# EAGLE design tv (EAGLE 9.2.2)
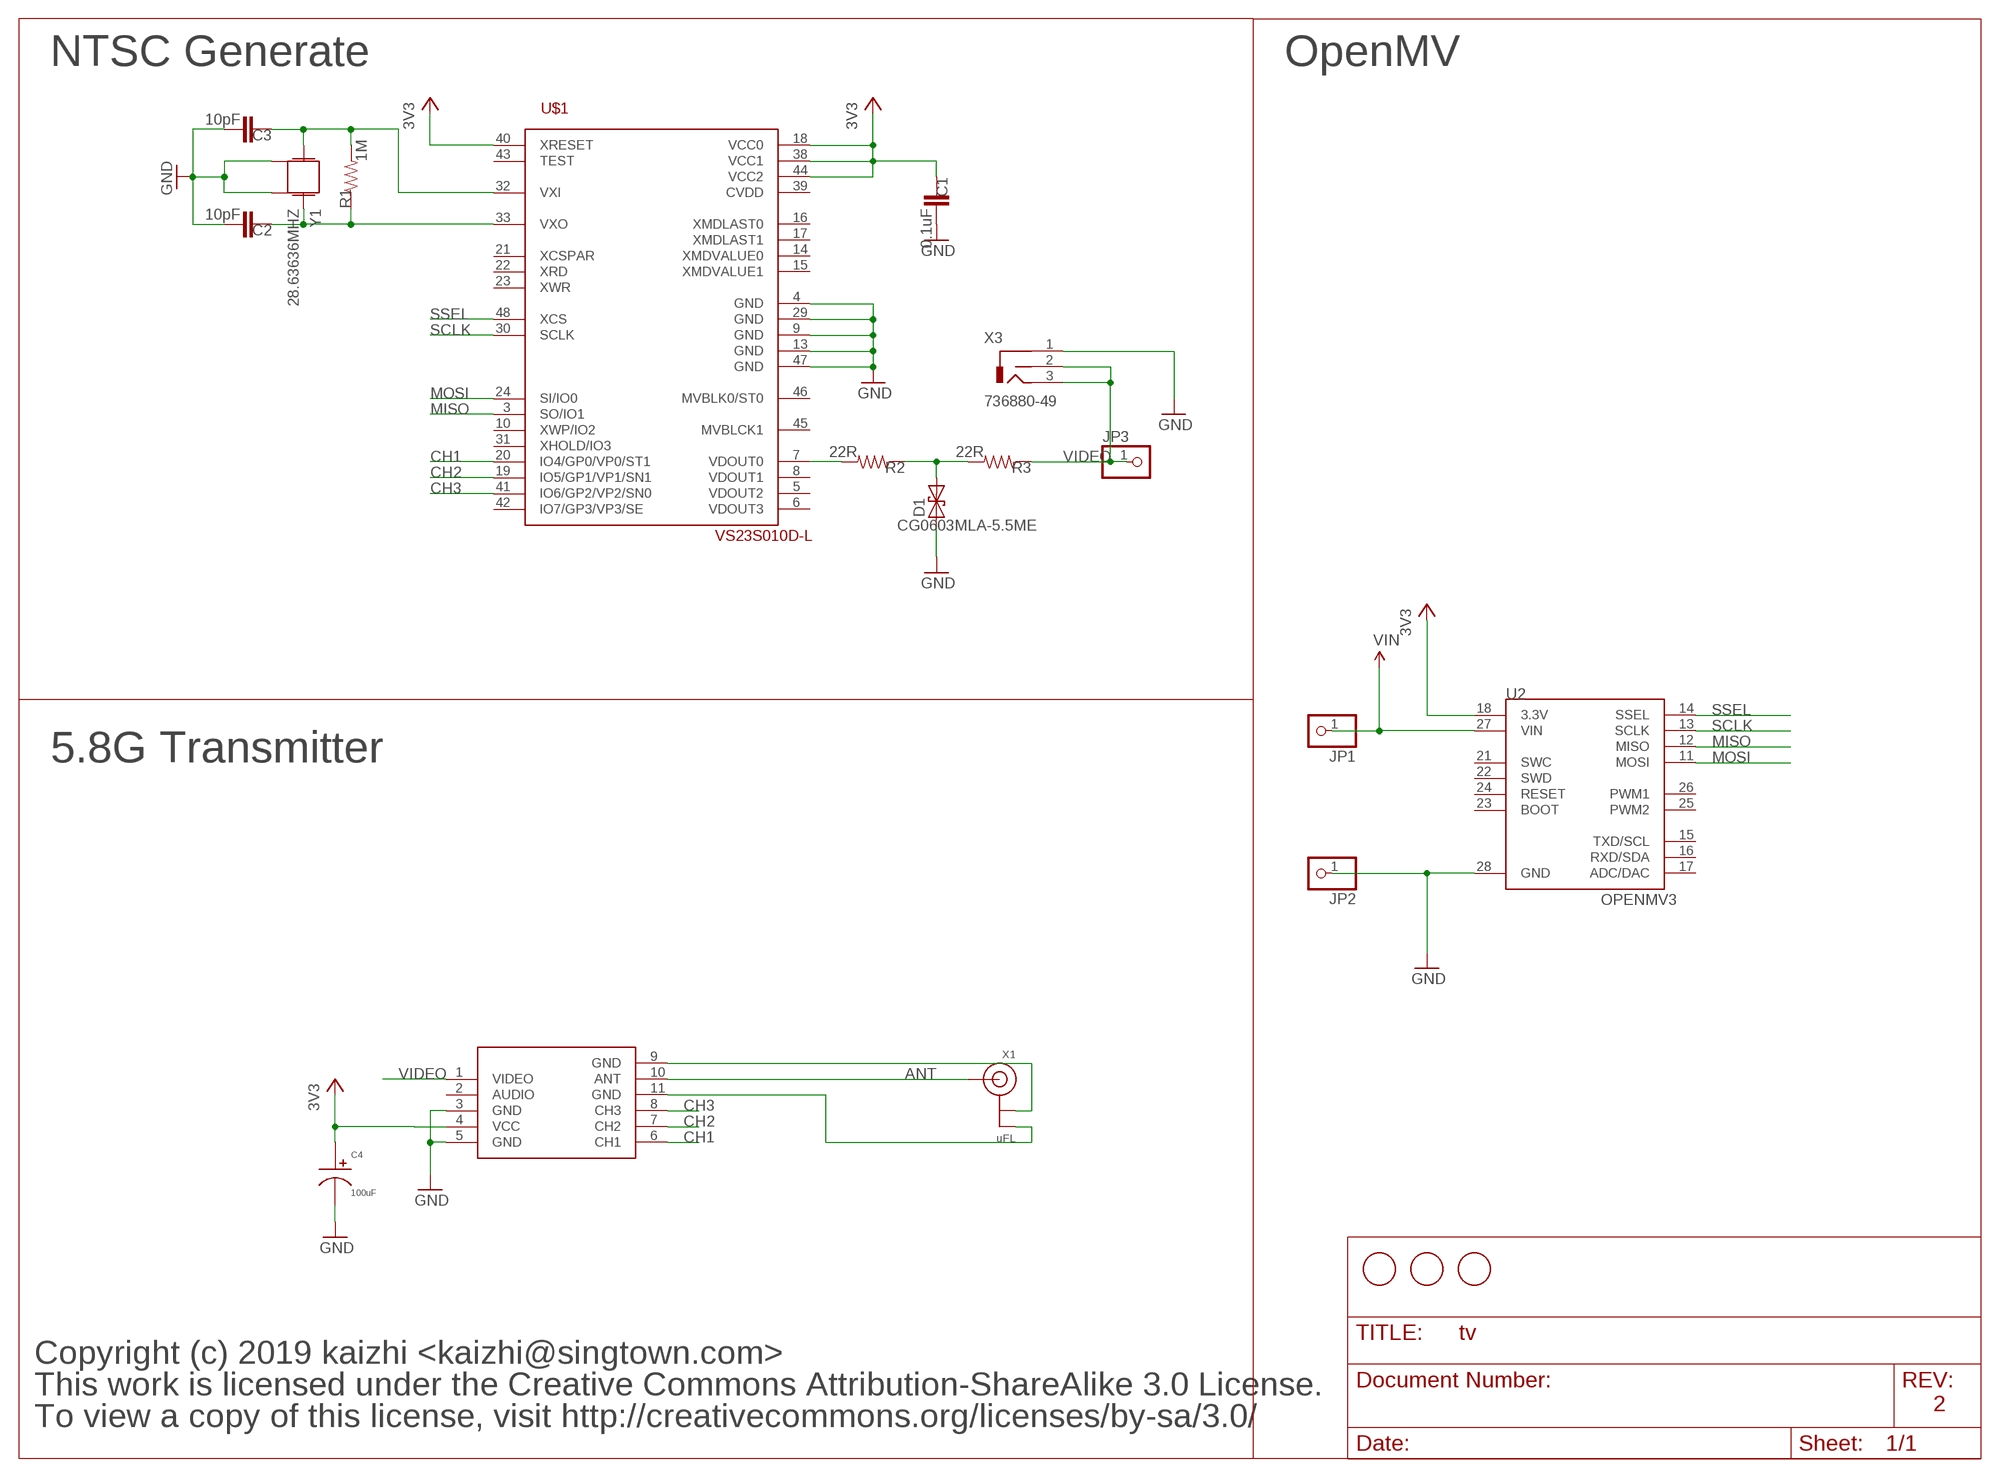
[diagram p0: schematic, sheet 1]

## Parts
C1  0.1uF  CAP0603-CAP  [0603-CAP]
C2  10pF  CAP0603-CAP  [0603-CAP]
C3  10pF  CAP0603-CAP  [0603-CAP]
C4  100uF  CAPACITOR_P_6.3MM  [CP6.3MM]
D1  CG0603MLA-5.5ME  15KEXXC  [C0603K]
JP1  PINHD-1X1  [1X01]
JP2  PINHD-1X1  [1X01]
JP3  PINHD-1X1  [1X01]
R1  1M  RESISTOR0603-RES  [0603-RES]
R2  22R  RESISTOR0603-RES  [0603-RES]
R3  22R  RESISTOR0603-RES  [0603-RES]
U1  VS23S010D-L  [LQFP48]
U2  OPENMV3  [OPENMV3]
U3  TX5813  [TX5813]
U$1  FIDUCIAL  [FIDUCIAL_1MM]
U$2  FIDUCIAL  [FIDUCIAL_1MM]
U$4  FIDUCIAL  [FIDUCIAL_1MM]
X1  uFL  ANTENNA_U.FL  [U.FL]
X3  736880-49  [736880-49]
Y1  28.63636MHZ  CRYSTAL3.2X2.5-CTX  [CRYSTAL-3.2X2.5-CTX851CT]

## Nets
3V3: C1.1 C4.P$1 U1.18(VCC0) U1.38(VCC1) U1.40(XRESET) U1.44(VCC2) U2.18(3.3V) U3.4(VCC)
ANT: U3.10(ANT) X1.3(SIGNAL)
CH1: U1.20(IO4/GP0/VP0/ST1) U3.6(CH1)
CH2: U1.19(IO5/GP1/VP1/SN1) U3.7(CH2)
CH3: U1.41(IO6/GP2/VP2/SN0) U3.8(CH3)
GND: C1.2 C2.2 C3.2 C4.P$2 D1.1 JP2.1 U1.4(GND) U1.9(GND) U1.13(GND) U1.29(GND) U1.47(GND) U2.28(GND) U3.3(GND) U3.5(GND) X3.1(GND) Y1.2 Y1.4
MISO: U1.3(SO/IO1) U2.12(MISO)
MOSI: U1.24(SI/IO0) U2.11(MOSI)
N$1: D1.2 R2.1 R3.2
N$2: R2.2 U1.7(VDOUT0)
N$3: U3.11(GND) X1.2(GND)
N$4: U3.9(GND) X1.1(GND)
N$22: C3.1 R1.2 U1.32(VXI) Y1.3
N$23: C2.1 R1.1 U1.33(VXO) Y1.1
SCLK: U1.30(SCLK) U2.13(SCLK)
SSEL: U1.48(XCS) U2.14(SSEL)
VIDEO: JP3.1 R3.1 U3.1(VIDEO) X3.2(COT) X3.3(SIGNAL)
VIN: JP1.1 U2.27(VIN)
Unconnected: U1.5(VDOUT2) U1.6(VDOUT3) U1.8(VDOUT1) U1.10(XWP/IO2) U1.14(XMDVALUE0) U1.15(XMDVALUE1) U1.16(XMDLAST0) U1.17(XMDLAST1) U1.21(XCSPAR) U1.22(XRD) U1.23(XWR) U1.31(XHOLD/IO3) U1.39(CVDD) U1.42(IO7/GP3/VP3/SE) U1.43(TEST) U1.45(MVBLCK1) U1.46(MVBLK0/ST0) U2.15(TXD/SCL) U2.16(RXD/SDA) U2.17(ADC/DAC) U2.21(SWC) U2.22(SWD) U2.23(BOOT) U2.24(RESET) U2.25(PWM2) U2.26(PWM1) U3.2(AUDIO)

## Notes on the sheet
- NTSC Generate | OpenMV
- 5.8G Transmitter
- Copyright (c) 2019 kaizhi <kaizhi@singtown.com>
- This work is licensed under the Creative Commons Attribution-ShareAlike 3.0 License.
- 2
- To view a copy of this license, visit http://creativecommons.org/licenses/by-sa/3.0/

## Library data of the parts
C1-C3 = sfe:CAP: Capacitor Standard 0603 ceramic capacitor, and 0.1" leaded capacitor.
C4 = MF_Passives:CAPACITOR_P: Library: MF_Passives Description: Device for Polarized Capacitors. Manufacture part number (MFG#), Voltage Rating, and Tolerance can be added via Attributes.; MFG#: N/A; TOLERANCE: N/A; VOTLAGE: N/A
D1 = esd:15KEXXC: DIODE
JP1-JP3 = pinhead:PINHD-1X1: PIN HEADER
R1-R3 = sfe:RESISTOR: Resistor Basic schematic elements and footprints for 0603, 1206, and PTH resistors.
U1 = vs23s010:VS23S010D-L
U2 = openmv:OPENMV3
U3 = tx58:TX5813
U$1 U$2 U$4 = adafruit:FIDUCIAL: For use by pick and place machines to calibrate the vision/machine, 1mm By microbuilder.eu
X1 = microbuilder:ANTENNA_U.FL: U.FL Antenna Connector
X3 = con-conrad:736880-49: Cinch Connector ( RCA Jack ) Cinch-Einbaukupplung 90º 72345 Vernickelt BKL Electronic Source: Conrad <http://www.conrad.de/ce/de/product/736880>
Y1 = mux:CRYSTAL: Crystals Various standard crystals. Proven footprints. Spark Fun Electronics SKU : COM-00534

## Net classes
1 vcc: width 1.016 mm, clearance 0.203 mm
2 antenna: width 0.363 mm, clearance 0.305 mm
3 1.8v: width 0.457 mm, clearance 0.254 mm

## Board
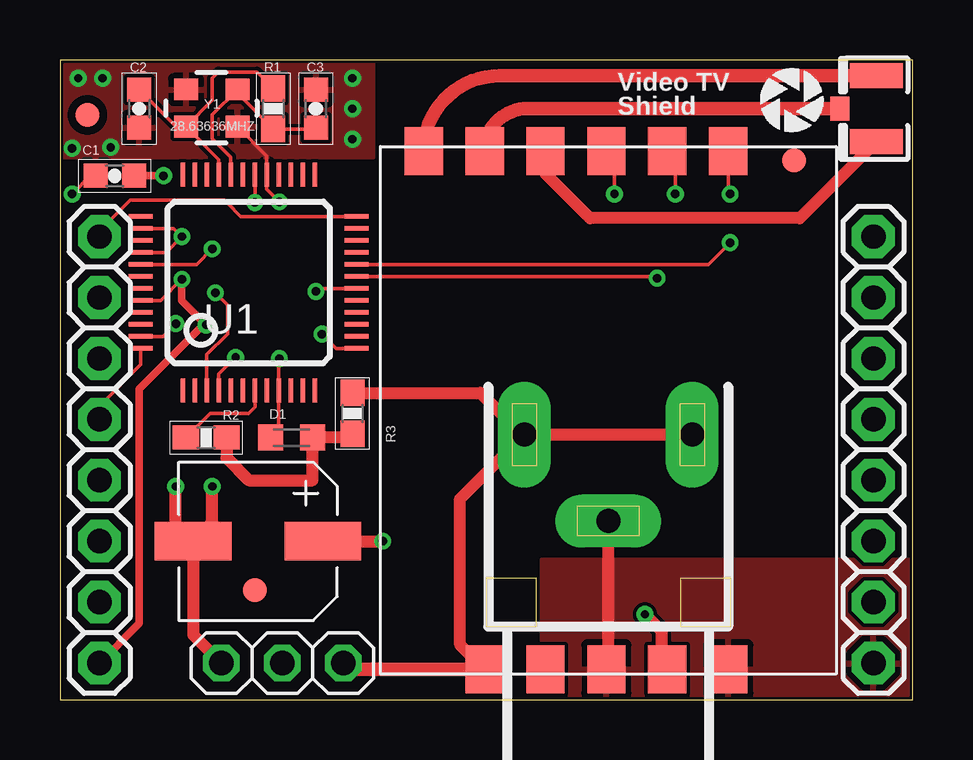
[diagram p1: board, top side]
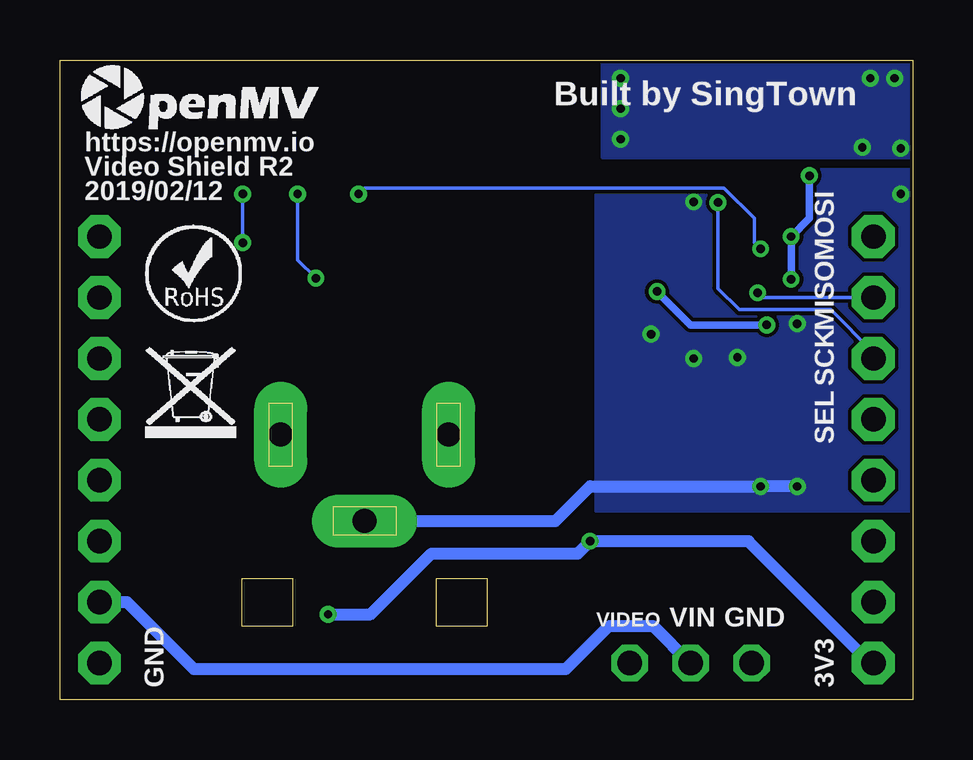
[diagram p2: board, bottom side, seen from below]

Size 35.56 x 26.67 mm. Coordinates in mm from the lower left corner, seen from the top.
Outline: 0,0 35.56,0 35.56,26.67 0,26.67 0,0
Copper layers (1+16): Top 0.035mm / dielectric 1.5mm / Bottom 0.035mm
Design rules "default *": minimum track width 6mil, minimum drill 13mil, track to track 6mil, track to pad 6mil, pad to pad 6mil, via to via 6mil, smd to smd 6mil, copper to edge 5mil, drill to drill 10mil, minimum pad ring 10mil, minimum via ring 4mil, stop-mask expansion 2mil, vias tented up to drill 20mil, thermal gap 10mil

### Footprints (pad centres in the part's own frame; a part is rotated, then mirrored left to right if it is on the bottom)
0603-CAP = smd 1 x 1: 1 -0.8,0; 2 0.8,0
CP6.3MM = smd 1.6 x 3.2: P$1 0,-2.7; P$2 0,2.7
C0603K = smd 1.05 x 1.08: 1 -0.875,0; 2 0.875,0
1X01 = drill 1.016 octagon: 1 0,0
0603-RES = smd 1.1 x 1: 1 -0.85,0; 2 0.85,0
LQFP48 = smd 1 x 0.2: 1 -4.5,2.75; 2 -4.5,2.25; 3 -4.5,1.75; 4 -4.5,1.25; 5 -4.5,0.75; 6 -4.5,0.25; 7 -4.5,-0.25; 8 -4.5,-0.75; 9 -4.5,-1.25; 10 -4.5,-1.75; 11 -4.5,-2.25; 12 -4.5,-2.75; 25 4.5,-2.75; 26 4.5,-2.25; 27 4.5,-1.75; 28 4.5,-1.25; 29 4.5,-0.75; 30 4.5,-0.25; 31 4.5,0.25; 32 4.5,0.75; 33 4.5,1.25; 34 4.5,1.75; 35 4.5,2.25; 36 4.5,2.75 | smd 0.2 x 1: 13 -2.75,-4.5; 14 -2.25,-4.5; 15 -1.75,-4.5; 16 -1.25,-4.5; 17 -0.75,-4.5; 18 -0.25,-4.5; 19 0.25,-4.5; 20 0.75,-4.5; 21 1.25,-4.5; 22 1.75,-4.5; 23 2.25,-4.5; 24 2.75,-4.5; 37 2.75,4.5; 38 2.25,4.5; 39 1.75,4.5; 40 1.25,4.5; 41 0.75,4.5; 42 0.25,4.5; 43 -0.25,4.5; 44 -0.75,4.5; 45 -1.25,4.5; 46 -1.75,4.5; 47 -2.25,4.5; 48 -2.75,4.5
OPENMV3 = drill 1.016 pad 1.778 octagon: 11 1.651,19.304; 12 1.651,16.764; 13 1.651,14.224; 14 1.651,11.684; 15 1.651,9.144; 16 1.651,6.604; 17 1.651,4.064; 18 1.651,1.524; 21 33.909,19.304; 22 33.909,16.764; 23 33.909,14.224; 24 33.909,11.684; 25 33.909,9.144; 26 33.909,6.604; 27 33.909,4.064; 28 33.909,1.524
TX5813 = smd 2 x 1.6: 1 -10.795,5.16; 2 -10.795,2.62; 3 -10.795,0.08; 4 -10.795,-2.46; 5 -10.795,-5; 6 10.795,-5; 7 10.795,-2.46; 8 10.795,0.08; 9 10.795,2.62; 10 10.795,5.16; 11 10.795,7.7
FIDUCIAL_1MM = smd 1 x 1: 1 0,0
U.FL = smd 2.2 x 1.05: 1 0,1.375; 2 0,-1.375 | smd 0.8 x 1: 3 1.525,0
736880-49 = drill 1 pad 2.2 long: 1 4.4,0; 2 8,-3.5; 3 8,3.5
CRYSTAL-3.2X2.5-CTX851CT = smd 1 x 0.9: 1 -1.1,-0.75; 2 1.05,-0.75; 3 1.05,0.8; 4 -1.1,0.8

### Placement (x,y rotation side)
C1  2.29,21.84 180 top
C2  3.3,24.64 270 top
C3  10.67,24.64 90 top
C4  8.26,6.6 90 top
D1  9.65,10.92 0 top
JP1  9.27,1.52 0 top
JP2  6.73,1.52 0 top
JP3  11.81,1.52 0 top
R1  8.89,24.64 270 top
R2  6.1,10.92 180 top
R3  12.19,11.94 270 top
U1  7.87,17.4 90 top
U2  0,0 0 top
U3  22.86,12.06 90 top
U$1  8.13,4.57 0 top
U$2  30.61,22.48 0 top
U$3  [OMV-LOGO-SMALL]  34.8,23.62 0 bottom
U$4  1.14,24.38 0 top
U$5  [ROHS]  32,15.75 0 bottom
U$6  [WEEE]  32,10.92 0 bottom
U$9  OPENMV-LOGO  [OPENMV-LOGO]  29.08,23.5 0 top
X1  34.04,24.64 180 top
X3  22.86,3.05 90 top
Y1  6.35,24.64 0 top

### Tracks (layer width: path | path; a pad name or v marks a point on that pad's centre or on a via)
3V3  (via drill 0.35)
  Top 0.152: U1.38 4.74,19.65 v5.08,19.3 4.42,18.65 U1.40 | U1.44 4.2,16.65 v5.08,17.53 | U1.18 10.8,17.15 v10.67,17.02
  Top 0.305: v5.08,17.53 5.08,16.76 5.08,16.64 v6.1,15.62 5.97,15.62 4.06,13.72 3.3,12.95 3.3,3.17 3.24,3.11 U2.18 | C1.1 v4.32,21.84
  Top 0.508: U3.4 25.07,1.52 25.07,2.87 v24.38,3.56 | C4.P$1 v13.46,6.6
  Bottom 0.305: v5.08,17.53 v5.08,19.3 4.32,20.07 v4.32,21.84 | v6.1,15.62 9.27,15.62 v10.67,17.02
  Bottom 0.508: v24.38,3.56 22.61,3.56 20.07,6.1 13.97,6.1 v13.46,6.6 6.86,6.6 1.78,1.52 U2.18
ANT
  Top 0.559: U3.10 arc-90 19.48,24.64 X1.3
CH1  (via drill 0.35)
  Top 0.152: U3.6 27.86,21.16 v27.94,21.08 | U1.20 27.04,18.15 v27.94,19.05
  Bottom 0.152: v27.94,19.05 v27.94,21.08
CH2  (via drill 0.35)
  Top 0.152: v25.65,21.08 25.65,22.53 U3.7 | U1.19 24.81,17.65 v24.89,17.57
  Bottom 0.152: v24.89,17.57 25.65,18.33 v25.65,21.08
CH3  (via drill 0.35)
  Top 0.152: U1.41 5.7,18.15 v6.35,18.8 | U3.8 23.11,22.53 v23.11,21.08
  Bottom 0.152: v6.35,18.8 6.6,19.05 6.6,20.07 7.87,21.34 22.86,21.34 v23.11,21.08
GND  (via drill 0.35)
  Top 0.152: U1.47 4.3,15.15 v4.83,15.68 | U1.4 6.62,13.57 v7.32,14.27 | v9.14,14.22 9.12,14.2 U1.9 9.12,11.27 D1.1 | U1.13 11.51,14.65 v10.92,15.24 | v9.14,20.76 8.62,21.28 U1.29 8.62,22.66 Y1.2 | C1.2 1.27,21.84 v0.51,21.08
  Top 0.508: U3.3 22.86,1.35 | U3.3 22.86,1.35 | C4.P$2 4.83,7.33 v4.83,8.89 | C4.P$2 6.35,7.4 v6.35,8.89 | JP2.1 5.55,2.7 C4.P$2 | U3.3 22.86,1.35 | 22.86,1.35 X3.1
  Bottom 0.508: v4.83,8.89 v6.35,8.89 13.46,8.89 14.9,7.45 X3.1
  other vias: 0.76,25.91 0.51,22.99 1.78,25.91 12.19,23.37 12.19,24.64 12.19,25.91 2.11,23.03
  pour Top: 0,26.67 13.08,26.67 13.08,22.61 0,22.61
  pour Bottom: 0,22.1 13.21,22.1 13.21,7.87 0,7.87
  pour Bottom: 0,26.67 12.95,26.67 12.95,22.61 0,22.61
  pour Top: 20.07,5.84 35.56,5.84 35.56,0 20.07,0
MISO  (via drill 0.35)
  Top 0.152: U1.3 6.12,14.38 6.99,15.24 6.99,16.45 v6.48,16.96
  Bottom 0.152: U2.12 6.28,16.76 v6.48,16.96
MOSI
  Top 0.152: U1.24 7.54,20.15 6.99,20.7 6.86,20.83 2.92,20.83 1.65,19.56 U2.11
N$1
  Top 0.508: R3.2 12.03,10.92 D1.2 10.53,9.14 7.87,9.14 6.95,10.07 R2.1
N$2
  Top 0.152: R2.2 6.26,11.94 7.87,11.94 8.13,12.19 U1.7
N$3
  Top 0.559: U3.11 arc-90 18.31,26.01 X1.2
N$4
  Top 0.508: X1.1 30.84,20.07 22.1,20.07 20.24,21.92 U3.9
N$22
  Top 0.152: U1.32 7.12,22.62 6.35,23.39 6.35,24.36 6.35,24.39 Y1.3 7.4,25.28 R1.2 10.62,23.79 C3.1
N$23
  Top 0.152: R1.1 8.22,26.16 6.6,26.16 6.35,25.91 6.35,24.99 Y1.1 | C2.1 4.85,23.89 Y1.1 | Y1.1 6.62,22.51 U1.33
SCLK  (via drill 0.35)
  Top 0.152: v8.13,20.73 U1.30
  Bottom 0.152: U2.13 1.65,14.48 3.43,16.26 7.24,16.26 8.13,17.14 v8.13,20.73
SSEL
  Top 0.152: U1.48 3.37,14.22 3.37,13.97 1.65,12.25 U2.14
VIDEO
  Top 0.508: U3.1 16.68,2.29 16.68,8.37 19.27,10.95 19.27,11.05 | R3.1 17.53,12.79 19.27,11.05 | 19.27,11.05 X3.3 X3.2
  Top 0.559: JP3.1 12.06,1.27 U3.1
VIN
  Bottom 0.508: JP1.1 10.79,3.05 12.7,3.05 14.48,1.27 29.97,1.27 32.77,4.06 U2.27

### Text on the board
tPlace: Video TV / Shield
bPlace: Built by SingTown | https://openmv.io | Video Shield R2 | 2019/02/12 | MOSI | MISO | SCK | SEL | GND | VIN | VIDEO | 3V3 | GND